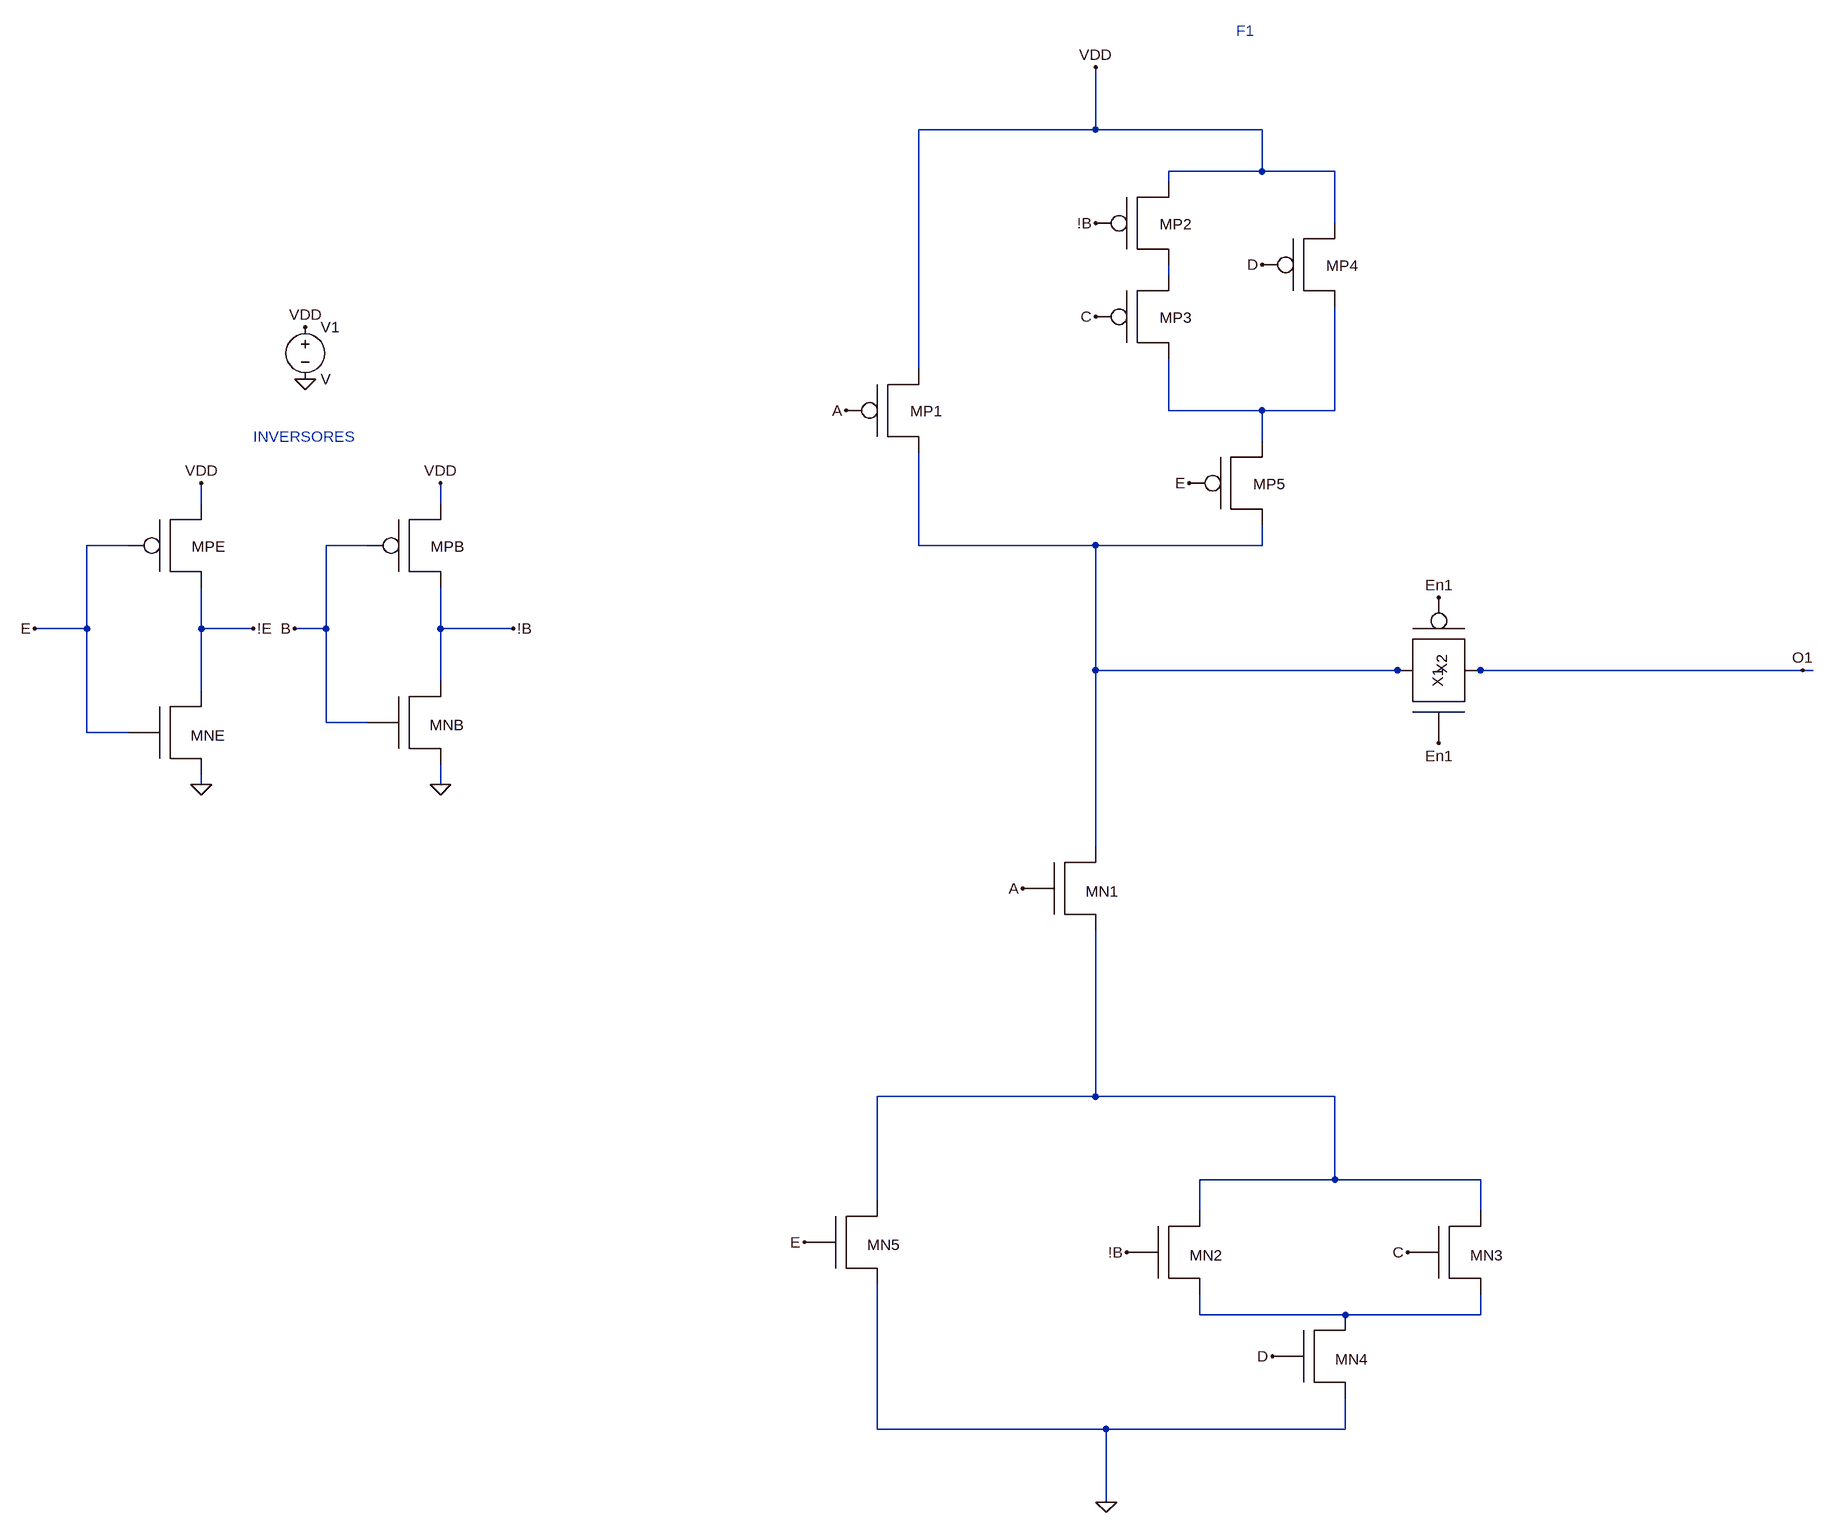
[diagram p0: schematic Trab2.asc]
Trab2.asc, the LTspice schematic file:
Version 4
SHEET 1 1624 1940
WIRE -768 -192 -768 -288
WIRE -768 -192 -1040 -192
WIRE -512 -192 -768 -192
WIRE -512 -128 -512 -192
WIRE -512 -128 -656 -128
WIRE -400 -128 -512 -128
WIRE -656 -112 -656 -128
WIRE -400 -48 -400 -128
WIRE -656 32 -656 16
WIRE -1040 176 -1040 -192
WIRE -656 240 -656 160
WIRE -512 240 -656 240
WIRE -400 240 -400 80
WIRE -400 240 -512 240
WIRE -512 288 -512 240
WIRE -2144 384 -2144 352
WIRE -1776 384 -1776 352
WIRE -2256 448 -2320 448
WIRE -1888 448 -1952 448
WIRE -1040 448 -1040 304
WIRE -768 448 -1040 448
WIRE -512 448 -512 416
WIRE -512 448 -768 448
WIRE -2320 576 -2320 448
WIRE -2320 576 -2400 576
WIRE -2144 576 -2144 512
WIRE -2064 576 -2144 576
WIRE -1952 576 -1952 448
WIRE -1952 576 -2000 576
WIRE -1776 576 -1776 512
WIRE -1664 576 -1776 576
WIRE -768 640 -768 448
WIRE -304 640 -768 640
WIRE 320 640 -176 640
WIRE 336 640 320 640
WIRE -1776 656 -1776 576
WIRE -2144 672 -2144 576
WIRE -1952 720 -1952 576
WIRE -1888 720 -1952 720
WIRE -2320 736 -2320 576
WIRE -2256 736 -2320 736
WIRE -2144 816 -2144 800
WIRE -1776 816 -1776 784
WIRE -768 912 -768 640
WIRE -768 1296 -768 1040
WIRE -768 1296 -1104 1296
WIRE -400 1296 -768 1296
WIRE -400 1424 -400 1296
WIRE -400 1424 -608 1424
WIRE -176 1424 -400 1424
WIRE -1104 1456 -1104 1296
WIRE -608 1472 -608 1424
WIRE -176 1472 -176 1424
WIRE -608 1632 -608 1600
WIRE -384 1632 -608 1632
WIRE -176 1632 -176 1600
WIRE -176 1632 -384 1632
WIRE -1104 1808 -1104 1584
WIRE -752 1808 -1104 1808
WIRE -384 1808 -384 1760
WIRE -384 1808 -752 1808
WIRE -752 1920 -752 1808
FLAG -2144 816 0
FLAG -2000 576 B
FLAG -2400 576 E
FLAG -1984 192 0
FLAG -1984 112 VDD
FLAG -1776 352 VDD
FLAG -2144 352 VDD
FLAG -1776 816 0
FLAG -1664 576 !B
FLAG -2064 576 !E
FLAG -768 -288 VDD
FLAG -1152 240 A
FLAG -768 -48 !B
FLAG -768 96 C
FLAG -512 16 D
FLAG -624 352 E
FLAG -880 976 A
FLAG -1216 1520 E
FLAG -720 1536 !B
FLAG -288 1536 C
FLAG -496 1696 D
FLAG -752 1920 0
FLAG 320 640 O1
FLAG -240 528 En1
FLAG -240 752 En1
SYMBOL PMOSX -2176 432 R0
SYMATTR InstName MPE
SYMBOL PMOSX -1808 432 R0
SYMATTR InstName MPB
SYMBOL NMOSX -2176 720 R0
SYMATTR InstName MNE
SYMBOL NMOSX -1808 704 R0
SYMATTR InstName MNB
SYMBOL voltage -1984 96 R0
SYMATTR InstName V1
SYMBOL PMOSX -1072 224 R0
SYMATTR InstName MP1
SYMBOL PMOSX -688 -64 R0
SYMATTR InstName MP2
SYMBOL PMOSX -688 80 R0
SYMATTR InstName MP3
SYMBOL PMOSX -432 0 R0
SYMATTR InstName MP4
SYMBOL PMOSX -544 336 R0
SYMATTR InstName MP5
SYMBOL NMOSX -800 960 R0
SYMATTR InstName MN1
SYMBOL NMOSX -640 1520 R0
SYMATTR InstName MN2
SYMBOL NMOSX -208 1520 R0
SYMATTR InstName MN3
SYMBOL NMOSX -416 1680 R0
SYMATTR InstName MN4
SYMBOL NMOSX -1136 1504 R0
SYMATTR InstName MN5
SYMBOL PMOSX -224 608 R90
SYMATTR InstName X1
SYMBOL NMOSX -256 672 R270
SYMATTR InstName X2
TEXT -2064 280 Left 2 ;INVERSORES
TEXT -552 -344 Left 2 ;F1

The netlist it stands for:
* Trab2.asc
XMPE !E E VDD PMOSX  ; pins D G S
XMPB !B B VDD PMOSX  ; pins D G S
XMNE !E E 0 NMOSX  ; pins D G S
XMNB !B B 0 NMOSX  ; pins D G S
V1 VDD 0 V
XMP1 N003 A VDD PMOSX  ; pins D G S
XMP2 N001 !B VDD PMOSX  ; pins D G S
XMP3 N002 C N001 PMOSX  ; pins D G S
XMP4 N002 D VDD PMOSX  ; pins D G S
XMP5 N003 E N002 PMOSX  ; pins D G S
XMN1 N003 A N004 NMOSX  ; pins D G S
XMN2 N004 !B N005 NMOSX  ; pins D G S
XMN3 N004 C N005 NMOSX  ; pins D G S
XMN4 N005 D 0 NMOSX  ; pins D G S
XMN5 N004 E 0 NMOSX  ; pins D G S
XX1 N003 En1 O1 PMOSX  ; pins D G S
XX2 N003 En1 O1 NMOSX  ; pins D G S
* INVERSORES
* F1
.backanno
.end